# EAGLE design connector (EAGLE 7.7.0)
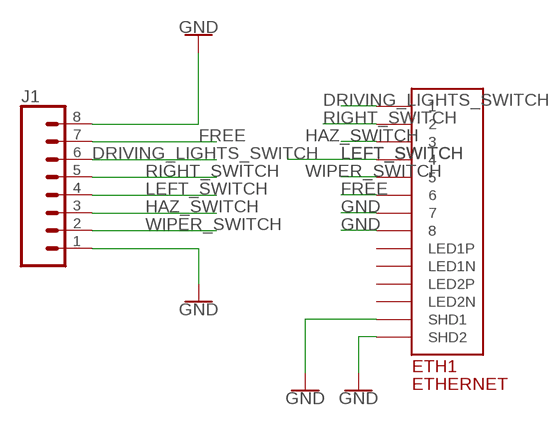
[diagram p0: schematic, sheet 1]

## Parts
ETH1  ETHERNET  [A122645-ND]
J1  CONN_08FEMALE_LOCK  [1X08_FEMALE_LOCK]

## Nets
DRIVING_LIGHTS_SWITCH: ETH1.P$1 J1.6
FREE: ETH1.P$6 J1.7
GND: ETH1.P$7 ETH1.P$8 ETH1.P$13(SHD1) ETH1.P$14(SHD2) J1.1 J1.8
HAZ_SWITCH: ETH1.P$3 J1.3
LEFT_SWITCH: ETH1.P$4 J1.4
RIGHT_SWITCH: ETH1.P$2 J1.5
WIPER_SWITCH: ETH1.P$5 J1.2
Unconnected: ETH1.P$9(LED1N) ETH1.P$10(LED1P) ETH1.P$11(LED2N) ETH1.P$12(LED2P)

## Library data of the parts
ETH1 = ETHERNET-3:ETHERNET: Ethernet port with 2 leds. digikey number A122645-ND
J1 = SparkFun-Connectors:CONN_08: Multi connection point. Often used as Generic Header-pin footprint for 0.1 inch spaced/style header connections On any of the 0.1 inch spaced packages, you can populate with these: Break Away Headers - Straight <https://www.sparkfun.com/products/116> (PRT-00116) Break Away Male Headers - Right Angle <https://www.sparkfun.com/products/553> (PRT-00553) Female Headers <https://www.sparkfun.com/products/115> (PRT-00115) Break Away Headers - Machine Pin <https://www.sparkfun.com/products/117> (PRT-00117) Break Away Female Headers - Swiss Machine Pin <https://www.sparkfun.com/products/743> (PRT-00743) Arduino Stackable Header - 8 Pin <https://www.sparkfun.com/products/9279> (PRT-09279) For SCREWTERMINALS and SPRING TERMINALS visit here: Screw Terimnals on SparkFun.com <https://www.sparkfun.com/search/results?term=Screw+Terminals> (5mm/3.5mm/2.54mm spacing) This device is also useful as a general connection point to wire up your design to another part of your project. Our various solder wires solder well into these plated through hole pads. Hook-Up Wire - Assortment (Stranded, 22 AWG) <https://www.sparkfun.com/products/11375> (PRT-11375) Hook-Up Wire - Assortment (Solid Core, 22 AWG) <https://www.sparkfun.com/products/11367> (PRT-11367) View the entire wire category on our website here <https://www.sparkfun.com/categories/141> Special notes: Molex polarized connector foot print use with SKU : PRT-08231 with associated crimp pins and housings. 1MM SMD Version SKU: PRT-10208 NOTES ON THE VARIANTS LOCK and LOCK_LONGPADS... This footprint was designed to help hold the alignment of a through-hole component (i.e. 6-pin header) while soldering it into place. You may notice that each hole has been shifted either up or down by 0.005 of an inch from it's more standard position (which is a perfectly straight line). This slight alteration caused the pins (the squares in the middle) to touch the edges of the holes. Because they are alternating, it causes a "brace" to hold the component in place. 0.005 has proven to be the perfect amount of "off-center" position when using our standard breakaway headers. Although looks a little odd when you look at the bare footprint, once you have a header in there, the alteration is very hard to notice. Also,if you push a header all the way into place, it is covered up entirely on the bottom side.; PROD_ID: CONN-09233; SF_ID: PRT-09279

## Board
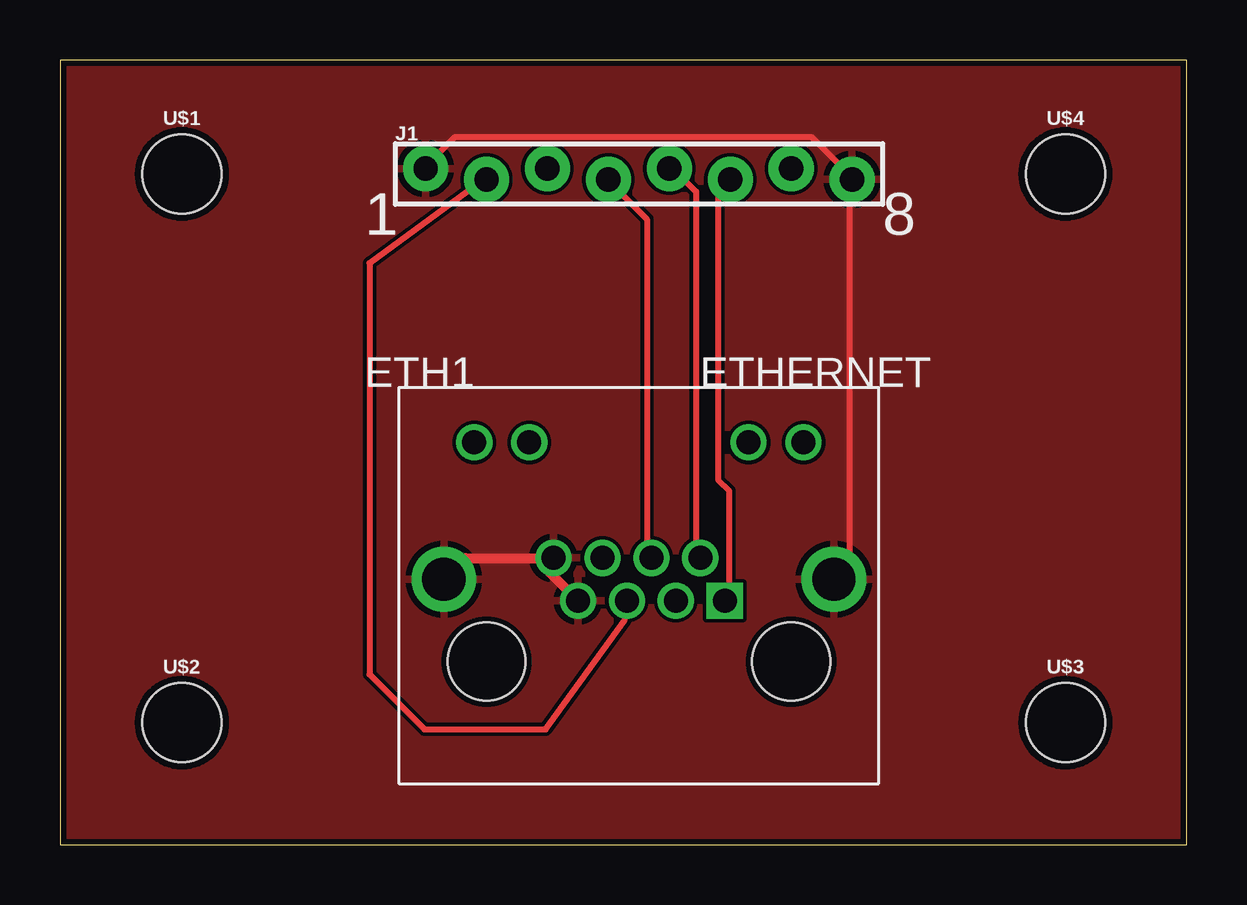
[diagram p1: board, top side]
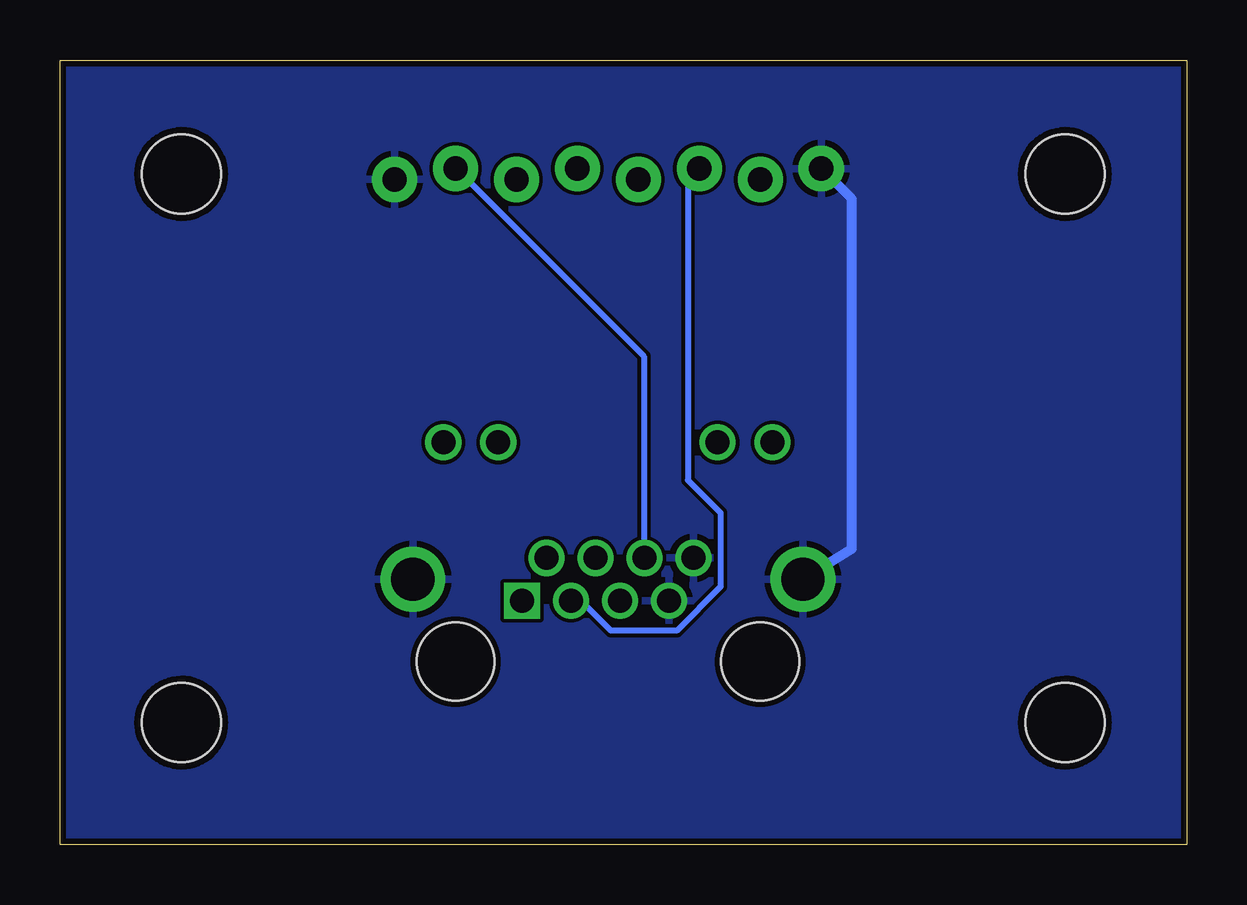
[diagram p2: board, bottom side, seen from below]

Size 46.97 x 32.69 mm. Coordinates in mm from the lower left corner, seen from the top.
Outline: 0,0 46.97,0 46.97,32.69 0,32.69 0,0
Copper layers (1*16): Top 0.035mm / dielectric 1.5mm / Bottom 0.035mm
Design rules "SeeedStudio_2layer_DRU_no_angle_20140221": minimum track width 6mil, minimum drill 12mil, track to track 6mil, track to pad 6mil, pad to pad 6mil, via to via 6mil, smd to smd 0mil, copper to edge 10mil, drill to drill 10mil, minimum pad ring 10mil, minimum via ring 6mil, stop-mask expansion 2mil, vias tented up to drill 100mil, thermal gap 10mil

### Footprints (pad centres in the part's own frame; a part is rotated, then mirrored left to right if it is on the bottom)
A122645-ND = drill 1 square: P$1 3.58,2.54 | drill 1: P$2 2.56,4.32; P$3 1.54,2.54; P$4 0.52,4.32; P$5 -0.5,2.54; P$6 -1.52,4.32; P$7 -2.54,2.54; P$8 -3.56,4.32; P$9 -6.86,9.14; P$10 -4.57,9.14; P$11 4.57,9.14; P$12 6.86,9.14 | drill 1.8: P$13 -8.13,3.43; P$14 8.13,3.43 | hole 3.25: -6.35,0; 6.35,0
1X08_FEMALE_LOCK = drill 1.016 pad 1.88: 1 0,0.229; 2 2.54,-0.229; 3 5.08,0.229; 4 7.62,-0.229; 5 10.16,0.229; 6 12.7,-0.229; 7 15.24,0.229; 8 17.78,-0.229
STAND-OFF = hole 3.302: 0,0

### Placement (x,y rotation side)
ETH1  24.13,7.62 0 top
J1  15.24,27.94 0 top
U$1  [STAND-OFF]  5.08,27.94 0 top
U$2  [STAND-OFF]  5.08,5.08 0 top
U$3  [STAND-OFF]  41.91,5.08 0 top
U$4  [STAND-OFF]  41.91,27.94 0 top

### Tracks (layer width: path | path; a pad name or v marks a point on that pad's centre or on a via)
DRIVING_LIGHTS_SWITCH
  Top 0.254: J1.6 27.43,27.2 27.43,15.19 27.89,14.73 27.89,10.29 ETH1.P$1
FREE
  Bottom 0.254: ETH1.P$6 22.63,12.12 22.63,20.34 30.4,28.12 J1.7
GND
  Top 0.254: ETH1.P$14 32.46,11.2 32.92,11.66 32.92,27.66 J1.8 32.92,27.89 31.32,29.49 16.46,29.49 15.32,28.35 J1.1
  Top 0.406: ETH1.P$7 20.32,11.43 | ETH1.P$13 16.89,11.94 ETH1.P$8
  Bottom 0.406: ETH1.P$13 13.97,12.32 13.97,26.9 J1.1
  pour Top: -1.27,34.29 -1.27,-1.27 48.26,-1.27 48.26,34.29
  pour Bottom: -2.54,34.29 -2.54,-1.27 48.26,-1.27 48.26,34.29
HAZ_SWITCH
  Bottom 0.254: ETH1.P$3 25.6,10.06 25.15,10.06 24,8.91 21.26,8.91 19.43,10.74 19.43,13.82 20.8,15.19 20.8,27.66 20.34,28.12 J1.3
LEFT_SWITCH
  Top 0.254: ETH1.P$4 24.46,12.12 24.46,26.06 22.86,27.66 J1.4
RIGHT_SWITCH
  Top 0.254: ETH1.P$2 26.52,12.12 26.52,27.2 25.6,28.12 J1.5
WIPER_SWITCH
  Top 0.254: ETH1.P$5 23.55,10.06 23.55,9.37 20.24,4.8 15.19,4.8 12.9,7.09 12.9,24.23 17.6,27.66 J1.2

### Text on the board
tNames: 1 | 8